# EAGLE design DP_pwer_controler_v2 (EAGLE 6.5.0)
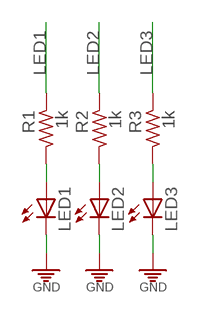
[diagram p0: schematic, sheet 1, part 1 of 2]
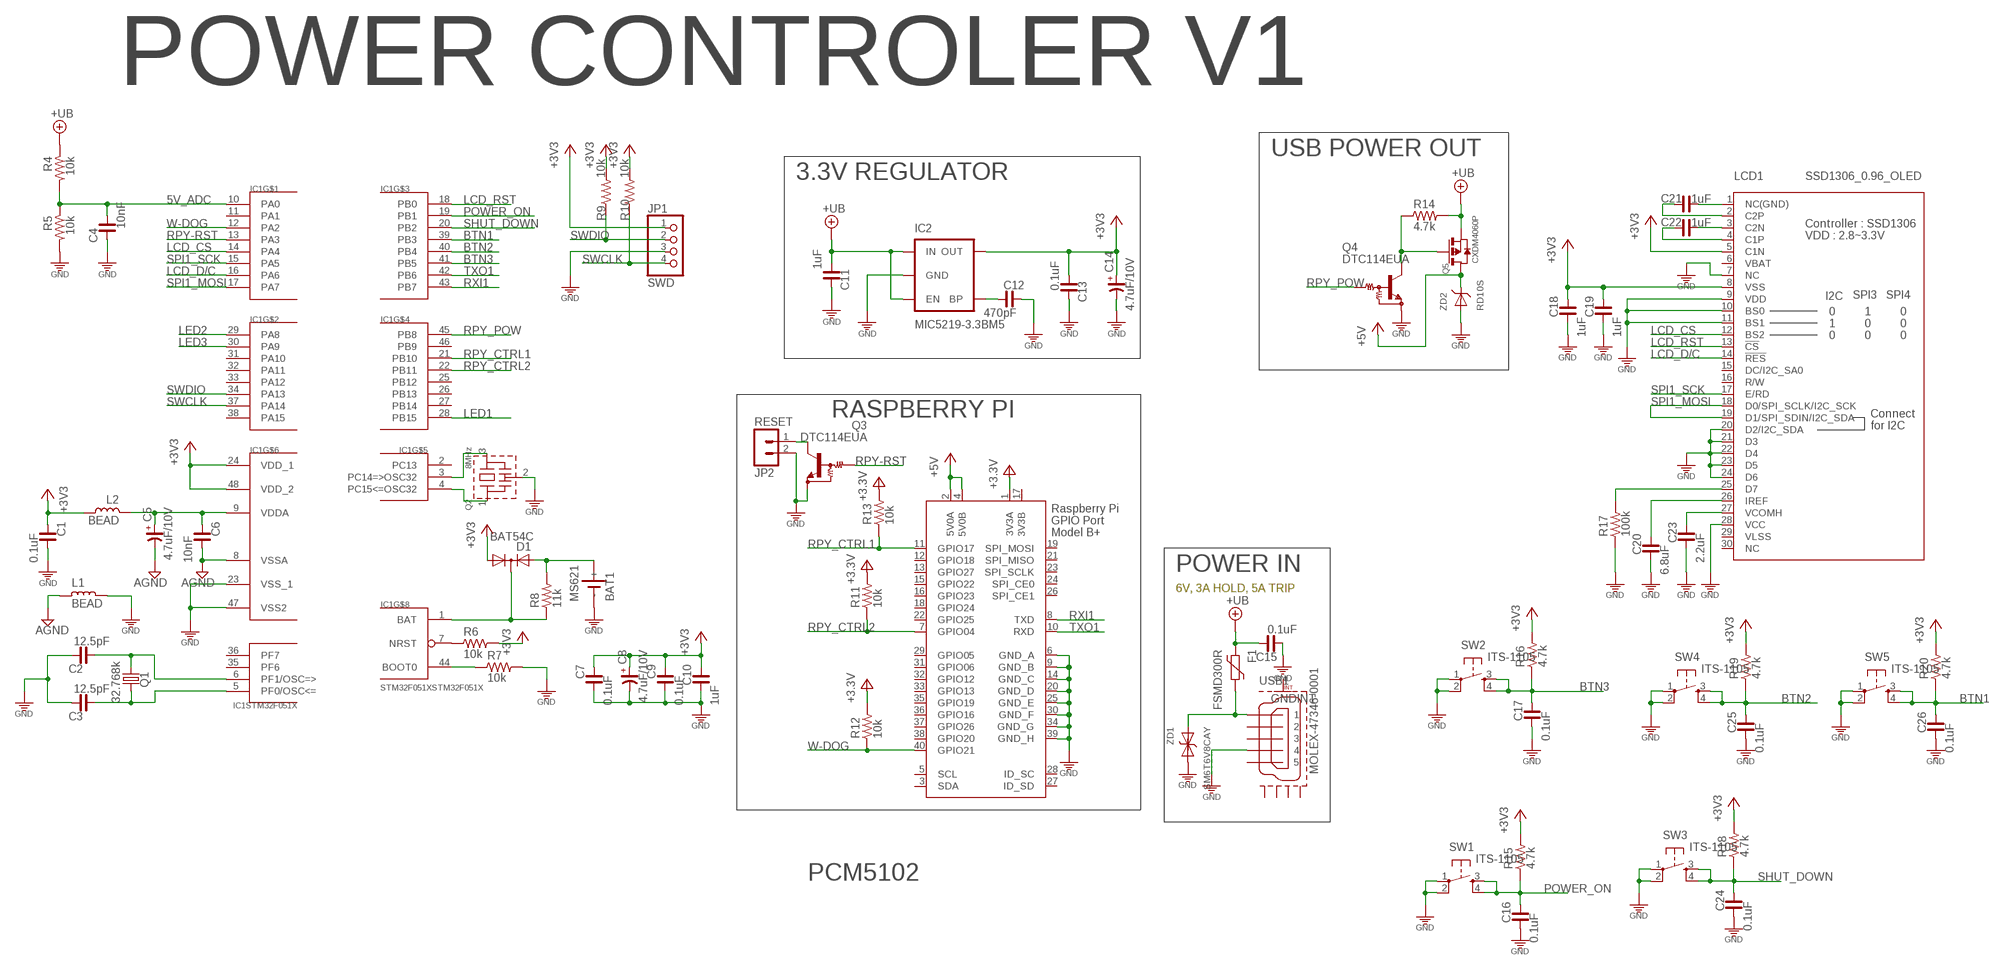
[diagram p1: schematic, sheet 1, part 2 of 2]

## Parts
BAT1  MS621  MS614  [MS621]
C1  0.1uF  C_0603  [C0603]
C2  12.5pF  C_0603  [C0603]
C3  12.5pF  C_0603  [C0603]
C4  10nF  C_0603  [C0603]
C5  4.7uF/10V  CP_2012  [C2012/T]
C6  10nF  C_0603  [C0603]
C7  0.1uF  C_0603  [C0603]
C8  4.7uF/10V  CP_2012  [C2012/T]
C9  0.1uF  C_0603  [C0603]
C10  1uF  C_0603  [C0603]
C11  1uF  C_0603  [C0603]
C12  470pF  C_0603  [C0603]
C13  0.1uF  C_0603  [C0603]
C14  4.7uF/10V  CP_2012  [C2012/T]
C15  0.1uF  C_0603  [C0603]
C16  0.1uF  C_0603  [C0603]
C17  0.1uF  C_0603  [C0603]
C18  1uF  C_0603  [C0603]
C19  1uF  C_0603  [C0603]
C20  6.8uF  C_0805  [C0805]
C21  1uF  C_0603  [C0603]
C22  1uF  C_0603  [C0603]
C23  2.2uF  C_0805  [C0805]
C24  0.1uF  C_0603  [C0603]
C25  0.1uF  C_0603  [C0603]
C26  0.1uF  C_0603  [C0603]
D1  BAT54C  [SOT23]
F1  FSMD300R  1812L  [1812L]
IC1  STM32F051XSTM32F051X  [TQFP48]
IC2  MIC5219-3.3BM5  V_REG_LDOSMD  [SOT23-5]
JP1  SWD  PINHD-1X4M  [1X04M]
JP2  RESET  MA02SMD  [MA02-1-MOL]
L1  BEAD  L_0603  [L0603]
L2  BEAD  L_0603  [L0603]
LCD1  SSD1306_0.96_OLED  [SSD1306_0.96OLED_BUTTOM]
LED1  LEDSMD-1608  [LED-1608]
LED2  LEDSMD-1608  [LED-1608]
LED3  LEDSMD-1608  [LED-1608]
Q1  32.768k  MC-306  [MC-306]
Q2  8MHz  X-TAL-SMALLCSTCE16M00V53  [CSTLA_X]
Q3  DTC114EUA  [SC59-BEC]
Q4  DTC114EUA  [SC59-BEC]
Q5  CXDM4060P  CXDM4060PCXDM4060P  [SOT89]
R1  1k  R_0603  [R0603]
R2  1k  R_0603  [R0603]
R3  1k  R_0603  [R0603]
R4  10k  R_0603  [R0603]
R5  10k  R_0603  [R0603]
R6  10k  R_0603  [R0603]
R7  10k  R_0603  [R0603]
R8  11k  R_0603  [R0603]
R9  10k  R_0603  [R0603]
R10  10k  R_0603  [R0603]
R11  10k  R_0603  [R0603]
R12  10k  R_0603  [R0603]
R13  10k  R_0603  [R0603]
R14  4.7k  R_0603  [R0603]
R15  4.7k  R_0603  [R0603]
R16  4.7k  R_0603  [R0603]
R17  100k  R_0603  [R0603]
R18  4.7k  R_0603  [R0603]
R19  4.7k  R_0603  [R0603]
R20  4.7k  R_0603  [R0603]
SW1  ITS-1105  [ITS-1105]
SW2  ITS-1105  [ITS-1105]
SW3  ITS-1105  [ITS-1105]
SW4  ITS-1105  [ITS-1105]
SW5  ITS-1105  [ITS-1105]
USB1  MOLEX-47346-0001  [MOLEX-47364-0001]
X1  RASPI_BOARD_B+#_F  [RASPI_BOARD_B+_FULL]
ZD1  SM6T6V8CAY  ZDSM6T33CAY  [SMB]
ZD2  RD10S  ZENER_DIODERD47S  [DSMM]

## Nets
3V3: R11.2 R12.2 R13.2 X1.1(3V3A) ; supply symbol labelled +3V3
5V_ADC: C4.2 IC1.10(PA0) R4.2 R5.1
+3V3: C1.1 C7.1 C8.+ C9.1 C10.1 C13.2 C14.+ C18.1 C19.1 D1.G IC1.24(VDD_1) IC1.48(VDD_2) IC2.5(OUT) JP1.1 L2.1 LCD1.5(C1N) LCD1.8(VSS) R6.2 R9.2 R10.2 R15.2 R16.2 R18.2 R19.2 R20.2
+5V: Q5.2(D) Q5.2@1(D) X1.2(5V0A) X1.4(5V0B) ZD2.C
+UB: C11.2 C15.1 F1.P$1 IC2.1(IN) IC2.3(EN) Q5.1(S) R4.1 R14.2
AGND: C5.- C6.2 IC1.8(VSSA) L1.2
BTN1: C26.1 IC1.39(PB3) R20.1 SW5.3 SW5.4
BTN2: C25.1 IC1.40(PB4) R19.1 SW4.3 SW4.4
BTN3: C17.1 IC1.41(PB5) R16.1 SW2.3 SW2.4
GND [GND]: BAT1.- C1.2 C2.1 C3.1 C4.1 C7.2 C8.- C9.2 C10.2 C11.1 C12.1 C13.1 C14.- C15.2 C16.2 C17.2 C18.2 C19.2 C20.2 C23.2 C24.2 C25.2 C26.2 IC1.23(VSS_1) IC1.47(VSS2) IC2.2(GND) JP1.3 JP2.2 L1.1 LCD1.7(NC) LCD1.9(VDD) LCD1.10(BS0) LCD1.11(BS1) LCD1.20(D2/I2C_SDA) LCD1.21(D3) LCD1.22(D4) LCD1.23(D5) LCD1.24(D6) LCD1.28(VCC) LED1.C LED2.C LED3.C Q2.2(GND) Q3.1(GND) Q4.1(GND) R5.2 R7.2 R17.1 SW1.1 SW1.2 SW2.1 SW2.2 SW3.1 SW3.2 SW4.1 SW4.2 SW5.1 SW5.2 USB1.4 X1.6(GND_A) X1.9(GND_B) X1.14(GND_C) X1.20(GND_D) X1.25(GND_E) X1.30(GND_F) X1.34(GND_G) X1.39(GND_H) ZD1.C(K) ZD2.A
LCD_CS: IC1.14(PA4) LCD1.12(BS2)
LCD_D/C: IC1.16(PA6) LCD1.14(!RES)
LCD_RST: IC1.18(PB0) LCD1.13(!CS)
LED1: IC1.28(PB15) R1.1
LED2: IC1.29(PA8) R2.1
LED3: IC1.30(PA9) R3.1
N$1: C12.2 IC2.4(BP)
N$2: F1.P$2 USB1.1 ZD1.A
N$3: IC1.7(NRST) R6.1
N$4: JP2.1 Q3.3(OUT)
N$8: C5.+ C6.1 IC1.9(VDDA) L2.2
N$9: BAT1.+ D1.S R8.2
N$13: IC1.3(PC14=>OSC32) Q2.3(OUT)
N$15: LCD1.25(D7) R17.2
N$16: IC1.44(BOOT0) R7.1
N$17: LED1.A R1.2
N$18: LED2.A R2.2
N$19: LED3.A R3.2
N$21: C21.1 LCD1.2(C2P)
N$22: C21.2 LCD1.1(NC(GND))
N$23: C22.2 LCD1.3(C2N)
N$24: C22.1 LCD1.4(C1P)
N$25: C20.1 LCD1.26(IREF)
N$26: C23.1 LCD1.27(VCOMH)
N$32: Q4.3(OUT) Q5.3(G) R14.1
N$33: D1.D IC1.1(BAT) R8.1
N$38: IC1.4(PC15<=OSC32) Q2.1(IN)
N$95: C3.2 IC1.5(STM32F051X:PF0/OSC<=) Q1.1
N$96: C2.2 IC1.6(STM32F051X:PF1/OSC=>) Q1.4
POWER_ON: C16.1 IC1.19(PB1) R15.1 SW1.3 SW1.4
RPY-RST: IC1.13(PA3) Q3.2(IN)
RPY_CTRL1: IC1.21(PB10) R13.1 X1.11(GPIO17)
RPY_CTRL2: IC1.22(PB11) R11.1 X1.7(GPIO04)
RPY_POW: IC1.45(PB8) Q4.2(IN)
RXI1: IC1.43(PB7) X1.8(TXD)
SHUT_DOWN: C24.1 IC1.20(PB2) R18.1 SW3.3 SW3.4
SPI1_MOSI: IC1.17(PA7) LCD1.18(D0/SPI_SCLK/I2C_SCK) LCD1.19(D1/SPI_SDIN/I2C_SDA)
SPI1_SCK: IC1.15(PA5) LCD1.17(E/RD)
SWCLK: IC1.37(PA14) JP1.4 R10.1
SWDIO: IC1.34(PA13) JP1.2 R9.1
TXO1: IC1.42(PB6) X1.10(RXD)
W-DOG: IC1.12(PA2) R12.1 X1.40(GPIO21)
Unconnected: IC1.2(PC13) IC1.11(PA1) IC1.25(PB12) IC1.26(PB13) IC1.27(PB14) IC1.31(PA10) IC1.32(PA11) IC1.33(PA12) IC1.35(STM32F051X:PF6) IC1.36(STM32F051X:PF7) IC1.38(PA15) IC1.46(PB9) LCD1.6(VBAT) LCD1.15(DC/I2C_SA0) LCD1.16(R/W) LCD1.29(VLSS) LCD1.30(NC) USB1.2 USB1.3 USB1.5 USB1.GND1 USB1.GND2 USB1.GND3 USB1.GND4 X1.3(SDA) X1.5(SCL) X1.12(GPIO18) X1.13(GPIO27) X1.15(GPIO22) X1.16(GPIO23) X1.18(GPIO24) X1.19(SPI_MOSI) X1.21(SPI_MISO) X1.22(GPIO25) X1.23(SPI_SCLK) X1.24(SPI_CE0) X1.26(SPI_CE1) X1.27(ID_SD) X1.28(ID_SC) X1.29(GPIO05) X1.31(GPIO06) X1.32(GPIO12) X1.33(GPIO13) X1.35(GPIO19) X1.36(GPIO16) X1.37(GPIO26) X1.38(GPIO20)

## Notes on the sheet
- https://webench.ti.com/webench5/power/webench5.cgi?app=filterarchitect&origin=ti_panel&filterType=Lowpass
- POWER CONTROLER V1
- USB POWER OUT
- 3.3V REGULATOR
- RASPBERRY PI
- POWER IN
- 6V, 3A HOLD, 5A TRIP
- PCM5102

## Power pins joined to a net without a drawn wire
3V3B: X1.17(3V3B)

## Library data of the parts
BAT1 = cona_lib:MS614: SII Micro Battery
C1-C4 C6 C7 C9-C13 C15-C26 = cona_lib:C_: NON-POLARIZED CAP
C5 C8 C14 = cona_lib:CP_: POLARIZED CAP
D1 = cona_lib:BAT54C
F1 = ptc-littlefuse:1812L
IC1 = stm32:STM32F051X
IC2 = SparkFun:V_REG_LDO: Voltage Regulator LDO Standard 150mA LDO voltage regulator in SOT-23 layout. Micrel part MIC5205. BP (by-pass) pin is used to lower output noise with 470pF cap.
JP1 = pinhead:PINHD-1X4: PIN HEADER
JP2 = cona_lib:MA02
L1 L2 = cona_lib:L_: INDUCTOR
LCD1 = OLED_Display:SSD1306_0.96_OLED
LED1-LED3 = cona_lib:LED: LED OSRAM: - CHIPLED LG R971, LG N971, LY N971, LG Q971, LY Q971, LO R971, LY R971 LH N974, LH R974 LS Q976, LO Q976, LY Q976 LO Q996 - Hyper CHIPLED LW Q18S LB Q993, LB Q99A, LB R99A - SideLED LS A670, LO A670, LY A670, LG A670, LP A670 LB A673, LV A673, LT A673, LW A673 LH A674 LY A675 LS A676, LA A676, LO A676, LY A676, LW A676 LS A679, LY A679, LG A679 - Hyper Micro SIDELED® LS Y876, LA Y876, LO Y876, LY Y876 LT Y87S - SmartLED LW L88C, LW L88S LB L89C, LB L89S, LG L890 LS L89K, LO L89K, LY L89K LS L896, LA L896, LO L896, LY L896 - TOPLED LS T670, LO T670, LY T670, LG T670, LP T670 LSG T670, LSP T670, LSY T670, LOP T670, LYG T670 LG T671, LOG T671, LSG T671 LB T673, LV T673, LT T673, LW T673 LH T674 LS T676, LA T676, LO T676, LY T676, LB T676, LH T676, LSB T676, LW T676 LB T67C, LV T67C, LT T67C, LS T67K, LO T67K, LY T67K, LW E67C LS E67B, LA E67B, LO E67B, LY E67B, LB E67C, LV E67C, LT E67C LW T67C LS T679, LY T679, LG T679 LS T770, LO T770, LY T770, LG T770, LP T770 LB T773, LV T773, LT T773, LW T773 LH T774 LS E675, LA E675, LY E675, LS T675 LS T776, LA T776, LO T776, LY T776, LB T776 LHGB T686 LT T68C, LB T68C - Hyper Mini TOPLED® LB M676 - Mini TOPLED Santana® LG M470 LS M47K, LO M47K, LY M47K Source: http://www.osram.convergy.de LUXEON: - LUMILED® LXK2-PW12-R00, LXK2-PW12-S00, LXK2-PW14-U00, LXK2-PW14-V00 LXK2-PM12-R00, LXK2-PM12-S00, LXK2-PM14-U00 LXK2-PE12-Q00, LXK2-PE12-R00, LXK2-PE12-S00, LXK2-PE14-T00, LXK2-PE14-U00 LXK2-PB12-K00, LXK2-PB12-L00, LXK2-PB12-M00, LXK2-PB14-N00, LXK2-PB14-P00, LXK2-PB14-Q00 LXK2-PR12-L00, LXK2-PR12-M00, LXK2-PR14-Q00, LXK2-PR14-R00 LXK2-PD12-Q00, LXK2-PD12-R00, LXK2-PD12-S00 LXK2-PH12-R00, LXK2-PH12-S00 LXK2-PL12-P00, LXK2-PL12-Q00, LXK2-PL12-R00 Source: www.luxeon.com KINGBRIGHT: KA-3528ASYC Source: www.kingbright.com
Q1 = crystal:MC-306: kHz RANGE CRYSTAL UNIT SMD Source: MC-306_405_406_E07X.PDF Homepage <http://www.epsontoyocom.co.jp>; MPN: MC-306 60.0KHZ 100PPM ,12.5PF; OC_FARNELL: 1278040; OC_NEWARK: 31M5576
Q2 = cona_lib:X-TAL-SMALL: Ceramic Resonators MuRata CSTCE08MOOG52A
Q3 Q4 = cona_lib:DTC114EUA: NPN Bias Resistor Transistor
Q5 = cona_lib:CXDM4060P
R1-R20 = cona_lib:R_: RESISTOR
SW1-SW5 = switch-tact:ITS-1105
USB1 = usb_con-update:MOLEX-47346-0001: MICRO USB B, BOTTOM MOUNT
X1 = raspberrypi_bastelstube_v13:RASPI_BOARD_B+#: Raspberry Pi GPIO connector with markings for the outer dimensions of the Raspberry Pi board model B+ with different sets of drill holes or mounting pads All pins connected
ZD1 = GRU-EURO6:ZD
ZD2 = GRU-EURO6:ZENER_DIODE

## Net classes
0 default: width 0.178 mm, drill 0.3 mm, clearance 0.178 mm
1 power: width 0.152 mm
2 GND: width 0.2 mm, clearance 0.152 mm

## Board
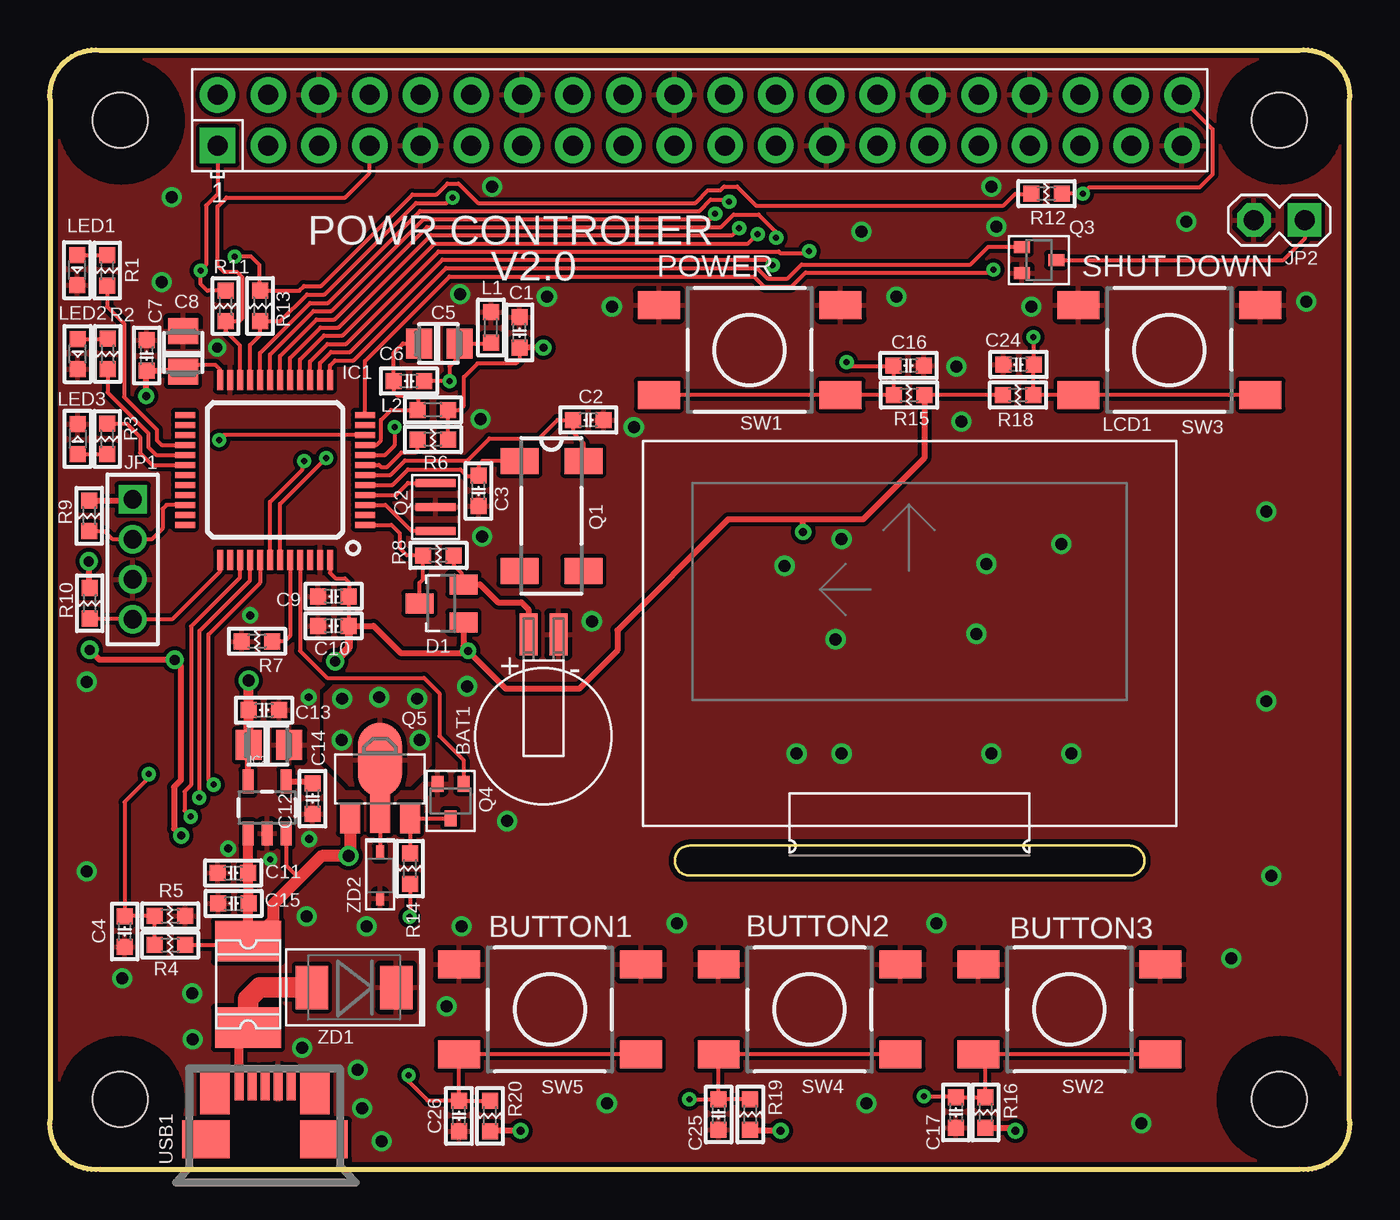
[diagram p2: board, top side]
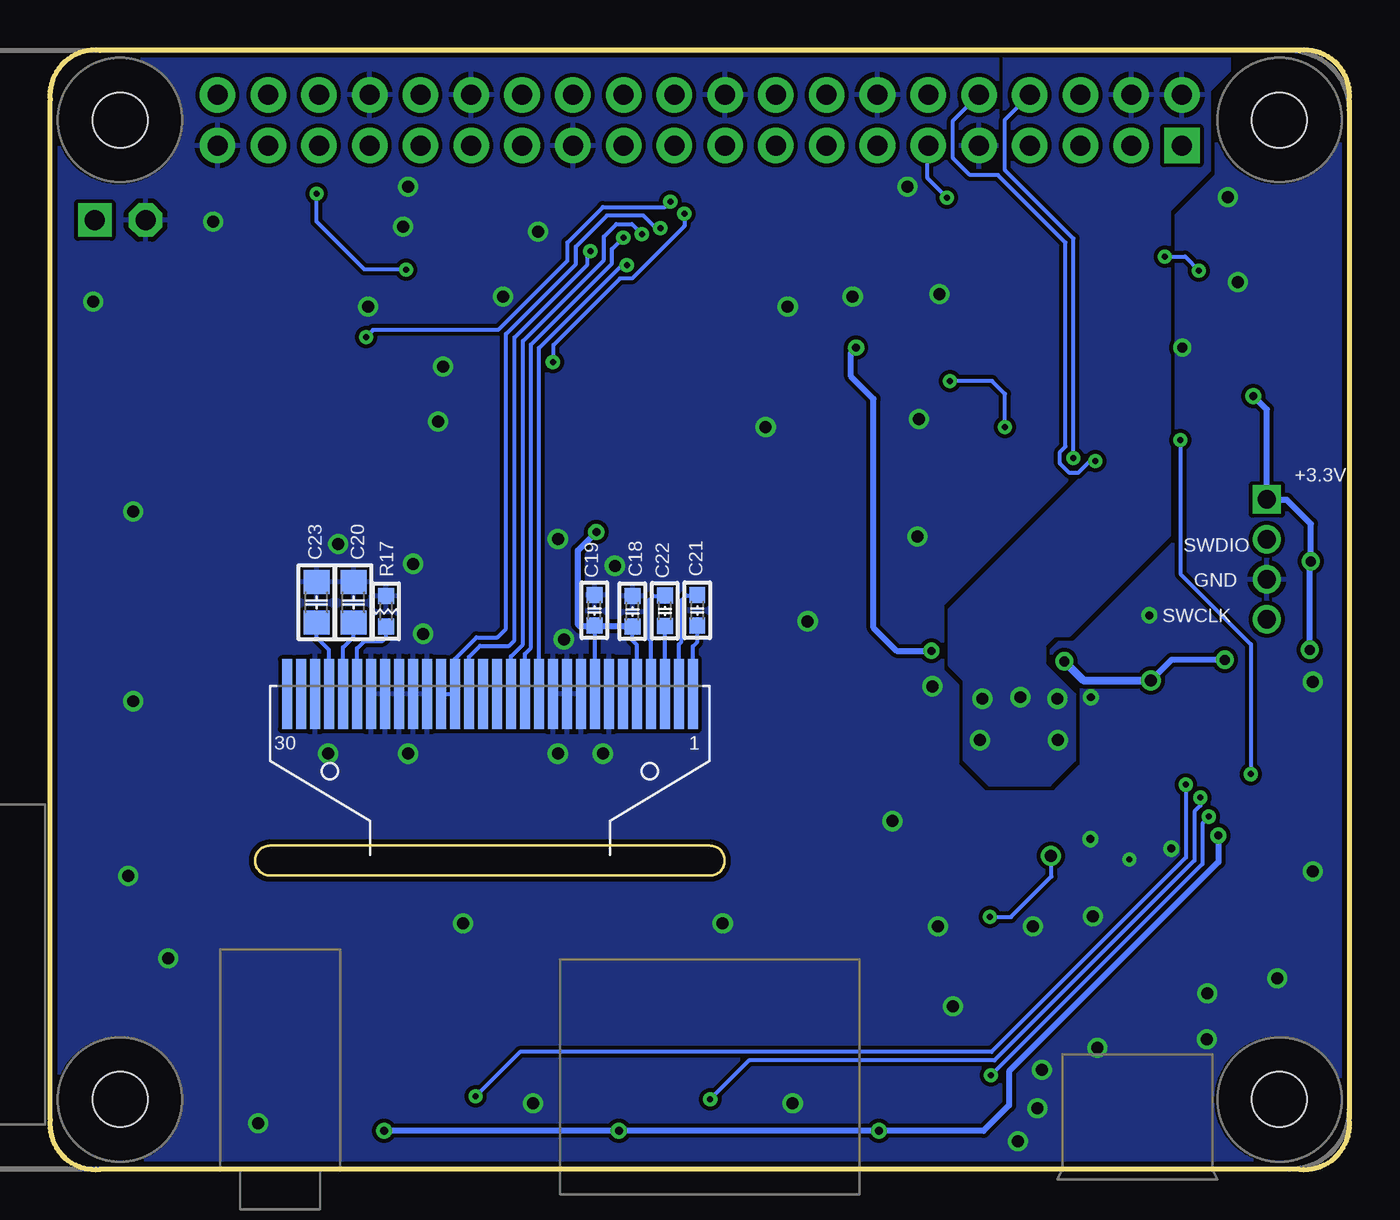
[diagram p3: board, bottom side, seen from below]

Size 65.03 x 56.03 mm. Coordinates in mm from the lower left corner, seen from the top.
Outline: 0.01,53.51 0.01,2.51 arc103 2.51,0.01 62.51,0.01 arc103 65.01,2.51 65.01,53.51 arc103 62.51,56.01 2.51,56.01 arc103 0.01,53.51
Copper layers (1*16): Top 0.035mm / dielectric 1.5mm / Bottom 0.035mm
Design rules "KHC_mm": minimum track width 0.2mm, minimum drill 0.3mm, track to track 0.2mm, track to pad 0.2mm, pad to pad 0.2mm, via to via 0.2mm, smd to smd 0.2mm, copper to edge 10mil, drill to drill 0.2mm, minimum pad ring 10mil, minimum via ring 8mil, stop-mask expansion 4mil, vias tented up to drill 0mil, thermal gap 10mil

### Footprints (pad centres in the part's own frame; a part is rotated, then mirrored left to right if it is on the bottom)
MS621 = smd 2.1 x 0.9: + 5.1,0.75; - 5.1,-0.75
C0603 = smd 0.8 x 0.8: 1 -0.762,0; 2 0.762,0
C2012/T = smd 1.3 x 1.5: + 1.016,0; - -1.016,0
C0805 = smd 1.2 x 1.3: 1 -1.016,0; 2 1.016,0
SOT23 = smd 1 x 1.4: D 0,-1.1; G 0.95,1.1; S -0.95,1.1
1812L = smd 2.03 x 3.3: P$1 -2.16,0; P$2 2.16,0
TQFP48 = smd 0.3 x 1: 1 -2.75,-4.5; 2 -2.25,-4.5; 3 -1.75,-4.5; 4 -1.25,-4.5; 5 -0.75,-4.5; 6 -0.25,-4.5; 7 0.25,-4.5; 8 0.75,-4.5; 9 1.25,-4.5; 10 1.75,-4.5; 11 2.25,-4.5; 12 2.75,-4.5; 25 2.75,4.5; 26 2.25,4.5; 27 1.75,4.5; 28 1.25,4.5; 29 0.75,4.5; 30 0.25,4.5; 31 -0.25,4.5; 32 -0.75,4.5; 33 -1.25,4.5; 34 -1.75,4.5; 35 -2.25,4.5; 36 -2.75,4.5 | smd 1 x 0.3: 13 4.5,-2.75; 14 4.5,-2.25; 15 4.5,-1.75; 16 4.5,-1.25; 17 4.5,-0.75; 18 4.5,-0.25; 19 4.5,0.25; 20 4.5,0.75; 21 4.5,1.25; 22 4.5,1.75; 23 4.5,2.25; 24 4.5,2.75; 37 -4.5,2.75; 38 -4.5,2.25; 39 -4.5,1.75; 40 -4.5,1.25; 41 -4.5,0.75; 42 -4.5,0.25; 43 -4.5,-0.25; 44 -4.5,-0.75; 45 -4.5,-1.25; 46 -4.5,-1.75; 47 -4.5,-2.25; 48 -4.5,-2.75
SOT23-5 = smd 0.55 x 1.2: 1 -0.95,-1.3; 2 0,-1.3; 3 0.95,-1.3; 4 0.95,1.3; 5 -0.95,1.3
1X04M = drill 0.914 square: 1 -3,0 | drill 0.914: 2 -1,0; 3 1,0; 4 3,0
MA02-1-MOL = drill 1 pad 1.676 square: 1 -1.27,0 | drill 1 pad 1.676 octagon: 2 1.27,0
L0603 = smd 0.8 x 0.8: 1 -0.762,0; 2 0.762,0
SSD1306_0.96OLED_BUTTOM = smd 0.5 x 3.5: 1 10.15,-5.22; 2 9.45,-5.22; 3 8.75,-5.22; 4 8.05,-5.22; 5 7.35,-5.22; 6 6.65,-5.22; 7 5.95,-5.22; 8 5.25,-5.22; 9 4.55,-5.22; 10 3.85,-5.22; 11 3.15,-5.22; 12 2.45,-5.22; 13 1.75,-5.22; 14 1.05,-5.22; 15 0.35,-5.22; 16 -0.35,-5.22; 17 -1.05,-5.22; 18 -1.75,-5.22; 19 -2.45,-5.22; 20 -3.15,-5.22; 21 -3.85,-5.22; 22 -4.55,-5.22; 23 -5.25,-5.22; 24 -5.95,-5.22; 25 -6.65,-5.22; 26 -7.35,-5.22; 27 -8.05,-5.22; 28 -8.75,-5.22; 29 -9.45,-5.22; 30 -10.15,-5.22
LED-1608 = smd 0.8 x 0.8: A -0.75,0; C 0.75,0
MC-306 = smd 1.3 x 1.9: 1 -2.75,-1.6; 2 2.75,-1.6; 3 2.75,1.6; 4 -2.75,1.6
CSTLA_X = smd 0.4 x 2: 1 -1.2,0; 2 0,0; 3 1.2,0
SC59-BEC = smd 0.6 x 0.8: 1 0.65,-0.863; 2 -0.65,-0.863; 3 0,0.863
SOT89 = smd 1 x 1.5: 1 -1.499,-1.981; 3 1.499,-1.981 | smd 1 x 2: 2 0,-1.727 | smd 2.2 x 3.7: 2@1 0,0.94
R0603 = smd 0.8 x 0.8: 1 -0.762,0; 2 0.762,0
ITS-1105 = smd 2.1 x 1.4: 1 -4.55,2.25; 2 4.55,2.25; 3 -4.55,-2.25; 4 4.55,-2.25
MOLEX-47364-0001 = smd 1.7 x 0.45: 1 2.8,1.3; 2 2.8,0.65; 3 2.8,0; 4 2.8,-0.65; 5 2.8,-1.3 | smd 1.9 x 2.375: GND1 0,2.95; GND4 0,-2.95 | smd 2.1 x 1.475: GND2 2.3,2.5; GND3 2.3,-2.5
RASPI_BOARD_B+_FULL = drill 1 pad 1.778 square: 1 8.37,51.23 | drill 1 pad 1.778: 2 8.37,53.77; 3 10.91,51.23; 4 10.91,53.77; 5 13.45,51.23; 6 13.45,53.77; 7 15.99,51.23; 8 15.99,53.77; 9 18.53,51.23; 10 18.53,53.77; 11 21.07,51.23; 12 21.07,53.77; 13 23.61,51.23; 14 23.61,53.77; 15 26.15,51.23; 16 26.15,53.77; 17 28.69,51.23; 18 28.69,53.77; 19 31.23,51.23; 20 31.23,53.77; 21 33.77,51.23; 22 33.77,53.77; 23 36.31,51.23; 24 36.31,53.77; 25 38.85,51.23; 26 38.85,53.77; 27 41.39,51.23; 28 41.39,53.77; 29 43.93,51.23; 30 43.93,53.77; 31 46.47,51.23; 32 46.47,53.77; 33 49.01,51.23; 34 49.01,53.77; 35 51.55,51.23; 36 51.55,53.77; 37 54.09,51.23; 38 54.09,53.77; 39 56.63,51.23; 40 56.63,53.77 | hole 2.75: 3.5,3.5; 3.5,52.5; 61.5,3.5; 61.5,52.5
SMB = smd 1.62 x 2.18: A 2.11,0; C -2.11,0
DSMM = smd 0.7 x 0.4: A 1.15,0; C -1.15,0

### Placement (x,y rotation side)
BAT1  24.69,21.69 90 top
C1  23.49,41.89 90 top
C2  26.94,37.51 180 top
C3  21.44,33.96 90 top
C4  3.74,11.91 90 top
C5  19.49,41.34 180 top
C6  17.96,39.46 0 top
C7  4.84,40.74 90 top
C8  6.66,40.94 270 top
C9  14.19,28.69 180 top
C10  14.19,27.21 180 top
C11  9.16,14.84 0 top
C12  13.14,18.56 90 top
C13  10.71,22.99 180 top
C14  10.96,21.24 180 top
C15  9.19,13.31 180 top
C16  42.96,40.24 0 top
C17  45.34,2.86 270 top
C18  35.89,27.94 90 bottom
C19  37.79,27.99 90 bottom
C20  49.84,28.39 90 bottom
C21  32.64,27.99 270 bottom
C22  34.26,27.96 270 bottom
C23  51.69,28.39 90 bottom
C24  48.46,40.29 180 top
C25  33.46,2.76 270 top
C26  20.46,2.69 270 top
D1  19.59,28.34 270 top
F1  9.91,9.26 270 top
IC1  11.26,35.01 90 top
IC2  10.86,18.11 0 top
JP1  4.14,30.54 270 top
JP2  61.51,47.51 180 top
L1  22.06,42.14 270 top
L2  19.16,38.01 180 top
LCD1  43.01,29.01 0 bottom
LED1  1.36,45.01 270 top
LED2  1.39,40.81 270 top
LED3  1.39,36.56 90 top
Q1  25.09,32.71 270 top
Q2  19.29,33.16 270 top
Q3  49.49,45.51 270 top
Q4  20.04,18.44 180 top
Q5  16.51,19.56 0 top
R1  2.86,44.99 90 top
R2  2.89,40.81 90 top
R3  2.86,36.56 270 top
R4  6.01,11.24 180 top
R5  6.01,12.69 0 top
R6  19.16,36.54 0 top
R7  10.36,26.44 180 top
R8  19.44,30.74 0 top
R9  1.96,32.71 90 top
R10  1.99,28.34 90 top
R11  8.79,43.21 90 top
R12  49.86,48.84 180 top
R13  10.51,43.21 90 top
R14  18.01,15.06 270 top
R15  42.99,38.76 0 top
R16  46.81,2.86 270 top
R17  48.21,27.94 270 bottom
R18  48.44,38.76 180 top
R19  35.04,2.76 270 top
R20  22.01,2.69 270 top
SW1  35.01,41.01 0 top
SW2  51.01,8.01 0 top
SW3  56.01,41.01 0 top
SW4  38.01,8.01 0 top
SW5  25.01,8.01 0 top
USB1  10.76,1.51 90 top
X1  0.01,0.01 0 top
ZD1  15.21,9.11 180 top
ZD2  16.51,14.71 270 top

### Tracks (layer width: path | path; a pad name or v marks a point on that pad's centre or on a via)
3V3  (via drill 0.3)
  Top 0.2: 49,48.74 R12.2 49.08,48.81 48.29,48.81 47.71,48.24 35.34,48.24 34.39,49.19 33.74,49.19 33.54,48.99 32.91,48.99 32.29,48.36 21.41,48.36 20.44,49.34 19.89,49.34 19.34,48.79 18.14,48.79 13.56,44.21 12.71,44.21 12.48,43.98 R13.2 10.49,44 10.49,45.26 10.06,45.69 v9.24,45.69 | R11.2 7.88,43.98 7.54,44.31 v7.54,44.99 v7.53,44.99 7.81,45.27 7.81,48.24 8.38,48.81 X1.1
  Bottom 0.2: v9.24,45.69 8.23,45.69 v7.53,44.99
5V_ADC  (via drill 0.3)
  Top 0.2: R4.2 R5.1 3.75,12.69 C4.2 3.74,18.39 4.94,19.59 v4.94,19.79 | IC1.10 8.71,36.76 v8.46,36.51
  Bottom 0.2: v8.46,36.51 8.46,29.81 4.94,26.29 v4.94,19.79
+3V3  (via drill 0.4, 0.5, 0.6)
  Top 0.2: R6.2 L2.1 20.49,38.01 20.71,38.24 20.71,39.66 21.39,40.34 23.31,40.34 23.49,40.51 C1.1 | IC1.48 14.01,29.86 14.29,29.59 14.76,29.59 14.96,29.39 C9.1 C10.1 | IC1.24 8.51,40.04 8.29,40.26 7,40.26 C8.+ | R18.2 R15.2
  Top 0.3: v1.94,30.44 1.94,29.15 R10.2 | R9.2 4.08,33.48 JP1.1 | v4.81,38.71 4.81,39.95 C7.1 6.61,39.98 C8.+ | 14.94,27.2 C10.1 16.19,27.21 17.54,25.86 20.81,25.86 v20.91,25.96 | v24.69,41.14 23.58,41.14 C1.1 | v6.56,16.71 6.21,17.06 6.21,19.14 6.56,19.49 6.56,25.19 v6.24,25.51 2.49,25.51 v1.99,26.01 2.01,25.99 | v23.54,1.94 22.03,1.94 R20.2 | v36.56,1.94 35.1,1.94 R19.2 | v48.31,1.94 48.29,1.94 48.16,2.06 46.85,2.06 R16.2 | IC2.5 9.91,21.2 C14.+ | D1.G 20.69,26.19 v20.91,25.96 | R15.2 43.75,35.6 40.69,32.54 37.69,32.54 | 37.69,32.54 33.94,32.54 28.39,26.99 28.39,25.99 26.46,24.06 22.81,24.06 v20.91,25.96 | v37.69,31.91 37.69,32.54
  Top 0.4: 14.94,27.2 14.94,26.11 v14.26,25.44
  Top 0.5: 9.91,21 C14.+ 9.95,22.88 C13.2 v9.95,24.48
  Bottom 0.2: LCD1.8 37.76,27.2 C19.1 37.74,27.18 C18.1 35.89,26.49 35.66,26.26 LCD1.5
  Bottom 0.3: v4.81,38.71 4.14,38.04 JP1.1 4.11,33.51 3.14,33.51 1.94,32.31 v1.94,30.44 1.99,30.39 v1.99,26.01 | v24.69,41.14 24.94,40.89 24.94,39.69 23.81,38.56 23.81,27.11 22.66,25.96 v20.91,25.96 | v6.56,16.71 6.56,15.39 17.04,4.91 17.04,3.21 18.31,1.94 v23.54,1.94 v36.56,1.94 v48.31,1.94 | C18.1 38.5,27.18 38.61,27.29 38.61,30.99 v37.69,31.91 | v6.24,25.51 8.91,25.51 v9.95,24.48
  Bottom 0.4: v14.26,25.44 13.31,24.49 9.96,24.49 v9.95,24.48
+5V  (via drill 0.6)
  Top 0.2: Q5.2 ZD2.C
  Top 0.3: Q5.2 Q5.2@1
  other vias: 14.61,23.56 14.59,21.49 18.36,23.56 18.49,21.49 16.46,23.64
  pour Top: 13.76,20.51 15.01,19.26 18.01,19.26 19.01,20.26 19.01,23.76 18.51,24.26 14.26,24.26 13.76,23.76
  pour Bottom: 18.01,19.26 15.01,19.26 13.76,20.51 13.76,23.76 15.26,25.26 15.26,26.26 14.76,26.76 14.01,26.76 9.01,31.76 9.01,48.01 7.01,50.01 7.01,54.01 6.01,55.01 6.01,56.01 17.26,56.01 17.26,50.51 13.51,46.76 13.51,34.51 20.01,28.01 20.01,25.26 19.26,24.51 19.26,20.51
+UB  (via drill 0.3, 0.6)
  Top 0.2: R14.2 18.01,12.66 v17.99,12.64 | Q5.1 | IC2.3 11.81,15.21 12.46,14.56 | R4.1 9.87,11.24 F1.P$1
  Top 0.5: F1.P$1 9.91,13.38 C15.1 C11.2 9.93,16.8 IC2.1
  Top 0.6: Q5.1 15.01,15.76 v14.94,15.69 13.59,15.69 12.46,14.56 11.16,13.26 11.16,12.45 F1.P$1
  Bottom 0.2: v17.99,12.64 16.94,12.64 14.91,14.66 14.91,15.66 v14.94,15.69
AGND  (via drill 0.3)
  Top 0.2: L1.2 21.88,41.34 C5.- 20.5,40.7 19.99,40.19 v19.99,39.46 C6.2 | IC1.8 16.76,35.76 17.24,36.24 v17.24,37.16
  Bottom 0.2: v19.99,39.46 17.89,39.46 17.24,38.81 v17.24,37.16
BTN1  (via drill 0.3)
  Top 0.2: IC1.39 9.51,29.64 7.06,27.19 7.06,19.24 6.74,18.91 6.74,17.96 v7.04,17.66 | C26.1 SW5.3 SW5.4 | C26.1 R20.1 | v17.94,4.71 17.94,4.41 18.89,3.46 20.45,3.46 C26.1
  Bottom 0.2: v7.04,17.66 7.04,17.64 7.36,17.31 7.36,15.29 v17.94,4.71
BTN2  (via drill 0.3)
  Top 0.2: IC1.40 10.01,29.49 7.49,26.96 7.49,18.64 v7.46,18.61 | SW4.4 SW4.3 C25.1 | R19.1 C25.1 | v31.99,3.51 33.45,3.51 C25.1
  Bottom 0.2: v7.46,18.61 7.46,18.21 7.76,17.91 7.76,15.46 17.76,5.46 30.04,5.46 v31.99,3.51
BTN3  (via drill 0.3)
  Top 0.2: IC1.41 10.51,29.36 7.94,26.79 7.94,19.51 v8.19,19.26 | v43.74,3.66 45.4,3.66 C17.1 R16.1 46.81,5.41 | 46.81,5.41 SW2.3 | SW2.4 47.16,5.76 46.81,5.41
  Bottom 0.2: v8.19,19.26 8.19,15.61 17.91,5.89 41.51,5.89 v43.74,3.66
GND  (via drill 0.3, 0.4, 0.5, 0.6)
  other vias: 11.01,15.51 39.31,26.54 36.76,30.21 39.61,31.56 46.36,26.81 39.61,20.81 37.36,20.81 47.11,20.81 51.11,20.81 50.61,31.31 46.86,30.31 44.36,12.31 31.36,12.31 20.59,12.16 59.11,10.56 15.39,4.99 15.61,3.06 7.14,6.51 7.11,8.81 12.61,6.09 15.84,12.16 19.84,8.16 16.59,1.41 1.84,14.91 12.96,16.54 8.91,16.06 12.94,23.64 10.01,27.74 3.61,9.56 1.84,24.41 5.59,44.41 6.09,48.66 8.36,41.14 20.51,43.81 21.54,37.56 29.21,37.16 28.11,43.19 27.11,27.44 21.61,31.69 20.86,24.19 22.86,17.44 61.11,14.69 60.86,23.44 60.86,32.94 49.11,43.19 42.36,43.69 45.36,40.19 62.86,43.44 56.86,47.44 40.61,46.94 47.36,47.19 24.86,43.69 47.11,49.19 22.11,49.19 54.61,2.31 27.86,3.31 40.86,3.31 12.84,12.66 45.61,37.44
  pour Top (rank 4): 0.01,0.01 0.01,56.01 76.01,56.01 76.01,0.01
  pour Bottom (rank 4): 0.01,0.01 0.01,56.01 76.01,56.01 76.01,0.01
LCD_CS  (via drill 0.3)
  Top 0.2: IC1.14 13.51,40.36 14.06,40.91 15.01,40.91 19.64,45.54 35.96,45.54 v36.16,45.26
  Bottom 0.2: LCD1.12 40.56,41.11 36.41,45.26 v36.16,45.26
LCD_D/C  (via drill 0.3)
  Top 0.2: IC1.16 12.51,40.54 13.71,41.74 14.64,41.74 19.24,46.34 34.94,46.34 v35.41,46.81
  Bottom 0.2: LCD1.14 41.96,25.69 41.36,26.29 41.36,41.46 37.31,45.51 37.31,46.69 36.69,47.31 35.91,47.31 v35.41,46.81
LCD_RST  (via drill 0.3)
  Top 0.2: IC1.18 11.51,40.71 13.34,42.54 14.24,42.54 18.86,47.16 33.59,47.16 34.21,47.79 35.46,47.79 36.34,46.91 v36.34,46.64
  Bottom 0.2: LCD1.13 41.26,25.81 40.96,26.11 40.96,41.29 36.91,45.34 36.91,46.06 v36.34,46.64
LED1
  Top 0.2: IC1.28 5.59,36.26 5.36,36.49 5.36,37.01 3.71,38.66 3.71,42.34 2.86,43.19 R1.1
LED2
  Top 0.2: IC1.29 5.31,35.76 4.94,36.14 4.94,36.84 2.89,38.89 R2.1
LED3
  Top 0.2: IC1.30 5.11,35.26 4.51,35.86 4.51,36.66 3.85,37.33 R3.1
N$1
  Top 0.3: IC2.4 13.05,19.41 C12.2
N$2
  Top 0.45: USB1.1 9.46,6.43 F1.P$2
  Top 1.016: ZD1.A 10.49,9.11 9.91,8.54 F1.P$2
N$3
  Top 0.2: IC1.7 16.46,35.26 16.56,35.16 16.86,35.16 17.59,35.89 18.31,35.89 18.39,35.96 18.39,36.53 R6.1
N$4
  Top 0.2: JP2.1 62.78,46.58 61.71,45.51 Q3.3
N$5
  cutout Top: 3.56,6.49 arc90 0.56,3.49 arc90 3.56,0.49 arc90 6.56,3.49 arc90
  cutout Bottom: 3.56,6.49 arc90 0.56,3.49 arc90 3.56,0.49 arc90 6.56,3.49 arc90
N$6
  cutout Top: 3.56,55.49 arc90 0.56,52.49 arc90 3.56,49.49 arc90 6.56,52.49 arc90
  cutout Bottom: 3.56,55.49 arc90 0.56,52.49 arc90 3.56,49.49 arc90 6.56,52.49 arc90
N$8
  Top 0.2: IC1.9 16.34,36.26 16.56,36.49 16.56,37.51 17.06,38.01 L2.2 18.41,38.03 18.41,38.56 18.24,38.74 17.39,38.74 17.2,38.93 C6.1 17.2,40.88 17.66,41.34 C5.+
N$9
  Top 0.2: R8.2 20.2,30.25 20.59,29.86 20.59,29.39 D1.S
  Top 0.3: D1.S 21.51,29.29 22.41,28.39 23.59,28.39 23.94,28.04 BAT1.+
N$10
  cutout Top: 61.56,55.49 arc90 58.56,52.49 arc90 61.56,49.49 arc90 64.56,52.49 arc90
  cutout Bottom: 61.56,55.49 arc90 58.56,52.49 arc90 61.56,49.49 arc90 64.56,52.49 arc90
  cutout Bottom: 61.56,6.49 arc90 58.56,3.49 arc90 61.56,0.49 arc90 64.56,3.49 arc90
  cutout Top: 61.56,6.49 arc90 58.56,3.49 arc90 61.56,0.49 arc90 64.56,3.49 arc90
N$13
  Top 0.2: IC1.3 16.79,33.26 18.09,31.96 Q2.3
N$15
  Bottom 0.2: LCD1.25 49.66,26.09 49.29,26.46 48.39,26.46 48.21,26.64 R17.2
N$16
  Top 0.2: IC1.44 12.01,26.71 11.74,26.44 R7.1
N$17
  Top 0.2: LED1.A 2.85,45.76 R1.2
N$18
  Top 0.2: LED2.A 2.88,41.56 R2.2
N$19
  Top 0.2: LED3.A 2.85,35.81 R3.2
N$21
  Bottom 0.2: LCD1.2 33.56,26.29 33.44,26.41 33.44,28.49 33.19,28.74 32.65,28.74 C21.1
N$22
  Bottom 0.2: LCD1.1 32.86,26.19 32.64,26.41 C21.2
N$23
  Bottom 0.2: LCD1.3 C22.2
N$24
  Bottom 0.2: LCD1.4 34.96,26.46 35.04,26.54 35.04,28.51 34.84,28.71 34.28,28.71 C22.1
N$25
  Bottom 0.2: LCD1.26 50.36,26.14 49.84,26.66 C20.1
N$26
  Bottom 0.2: LCD1.27 51.06,26.01 51.69,26.64 C23.1
N$32
  Top 0.2: Q4.3 Q5.3 R14.1
N$33
  Top 0.2: IC1.1 17.09,32.26 17.51,31.84 17.51,31.09 17.86,30.74 R8.1 18.66,30.73 18.66,29.54 18.49,29.36 D1.D
N$38
  Top 0.2: IC1.4 17.31,33.76 17.91,34.36 Q2.1
N$95
  Top 0.2: IC1.5 17.14,34.26 17.91,35.04 20.54,35.04 20.86,34.71 21.43,34.71 C3.2 21.44,35.26 21.64,35.46 Q1.1
N$96
  Top 0.2: IC1.6 17.04,34.76 17.76,35.49 20.89,35.49 21.99,36.59 24.46,36.59 25.39,37.51 C2.2 26.18,36.88 26.69,36.36 Q1.4
POWER_ON  (via drill 0.3)
  Top 0.2: SW1.3 SW1.4 R15.1 42.23,40.21 C16.1 42.18,40.21 40.06,40.21 v39.86,40.41 | IC1.19 11.01,40.79 13.19,42.96 14.09,42.96 18.69,47.56 33.06,47.56 v33.29,47.84
  Bottom 0.2: v33.29,47.84 33.29,47.21 35.91,44.59 36.51,44.59 39.84,41.26 39.84,40.49 v39.86,40.41
RPY-RST
  Top 0.2: IC1.13 14.01,40.24 14.26,40.49 15.19,40.49 19.81,45.11 35.39,45.11 35.91,44.59 36.91,44.59 37.61,45.29 46.06,45.29 46.94,46.16 Q3.2
RPY_CTRL1  (via drill 0.3)
  Top 0.2: IC1.21 10.01,41.26 10.51,41.76 R13.1 11.53,42.45 12.86,43.79 13.74,43.79 18.31,48.36 19.84,48.36 v20.14,48.64
  Bottom 0.2: v20.14,48.64 21.11,49.61 21.11,51.21 X1.11
RPY_CTRL2
  Top 0.2: IC1.22 9.51,41.24 8.79,41.96 R11.1 9.48,42.45 9.64,42.61 9.64,44.64 9.36,44.91 8.71,44.91 8.39,45.24 8.39,48.19 8.84,48.64 14.76,48.64 15.99,49.86 15.99,51.23 X1.7
RPY_POW
  Top 0.2: Q4.2 20.69,20.49 19.49,21.69 19.49,23.84 18.71,24.61 13.86,24.61 12.51,25.96 IC1.45
RXI1  (via drill 0.3)
  Top 0.2: IC1.43 11.51,33.31 v13.81,35.61
  Bottom 0.2: v13.81,35.61 13.81,46.59 17.24,50.01 17.24,52.55 X1.8
SHUT_DOWN  (via drill 0.3)
  Top 0.2: SW3.4 SW3.3 R18.1 49.2,40.26 C24.1 49.21,40.3 v49.21,41.66 | IC1.20 10.51,40.86 13.01,43.36 13.91,43.36 18.51,47.96 32.49,47.96 33.06,48.54 33.89,48.54 v33.99,48.44
  Bottom 0.2: 33.99,48.36 v33.99,48.44 34.26,48.16 37.36,48.16 39.14,46.39 39.14,45.49 42.61,42.01 48.86,42.01 v49.21,41.66
SPI1_MOSI  (via drill 0.3)
  Top 0.2: IC1.17 12.01,40.61 13.54,42.14 14.44,42.14 19.06,46.76 34.16,46.76 v34.49,47.11
  Bottom 0.2: LCD1.19 LCD1.18 44.76,25.56 43.69,26.64 42.64,26.64 42.21,27.06 42.21,41.81 38.71,45.31 38.71,46.19 37.16,47.74 35.34,47.74 34.71,47.11 v34.49,47.11
SPI1_SCK  (via drill 0.3)
  Top 0.2: IC1.15 13.01,40.44 13.89,41.31 14.81,41.31 19.44,45.94 36.46,45.94 36.54,45.86 37.89,45.86 v37.99,45.96
  Bottom 0.2: LCD1.17 44.06,25.66 43.51,26.21 42.06,26.21 41.79,26.49 41.79,41.64 38.14,45.29 38.14,45.81 v37.99,45.96
SWCLK
  Top 0.2: R10.1 4.1,27.58 JP1.4 6.11,27.54 8.51,29.94 IC1.37
SWDIO
  Top 0.2: IC1.34 5.84,33.26 5.64,33.06 5.64,32.09 5.09,31.54 JP1.2 4.11,31.56 3.11,31.56 2.73,31.95 R9.1
TXO1  (via drill 0.3)
  Top 0.2: IC1.42 11.01,33.41 12.64,35.04 12.64,35.34 v12.71,35.46
  Bottom 0.2: X1.10 19.84,52.49 19.84,50.61 18.99,49.76 17.59,49.76 14.21,46.39 14.21,36.19 14.49,35.91 14.49,35.34 14.01,34.86 13.59,34.86 13.04,35.41 12.76,35.41 v12.71,35.46
W-DOG  (via drill 0.3)
  Top 0.2: IC1.12 15.76,40.46 19.99,44.69 35.24,44.69 35.74,44.19 37.11,44.19 37.81,44.89 47.06,44.89 v47.21,45.04 | v51.69,48.84 R12.1 | X1.40 56.64,53.58 58.16,52.06 58.16,49.79 57.51,49.14 51.99,49.14 v51.69,48.84 | 51.66,48.81 v51.69,48.84
  Bottom 0.2: v47.21,45.04 49.29,45.04 51.69,47.44 v51.69,48.84

### Text on the board
_tplace: POWR CONTROLER | POWER | SHUT DOWN | V2.0 | BUTTON1 | BUTTON2 | BUTTON3
_bplace: +3.3V | SWDIO | GND | SWCLK